# Altium schematic sheet Base.SchDoc
size Letter; CompanyName: PloopyCo; Organization: Ploopy Co; Address1: 137-1140 Burnhamthorpe Road W; Address2: Mississauga; Address3: Ontario; Address4: Canada L5C 0A3; DocumentNumber: 1; Revision: R1.004; SheetNumber: 1; SheetTotal: 8
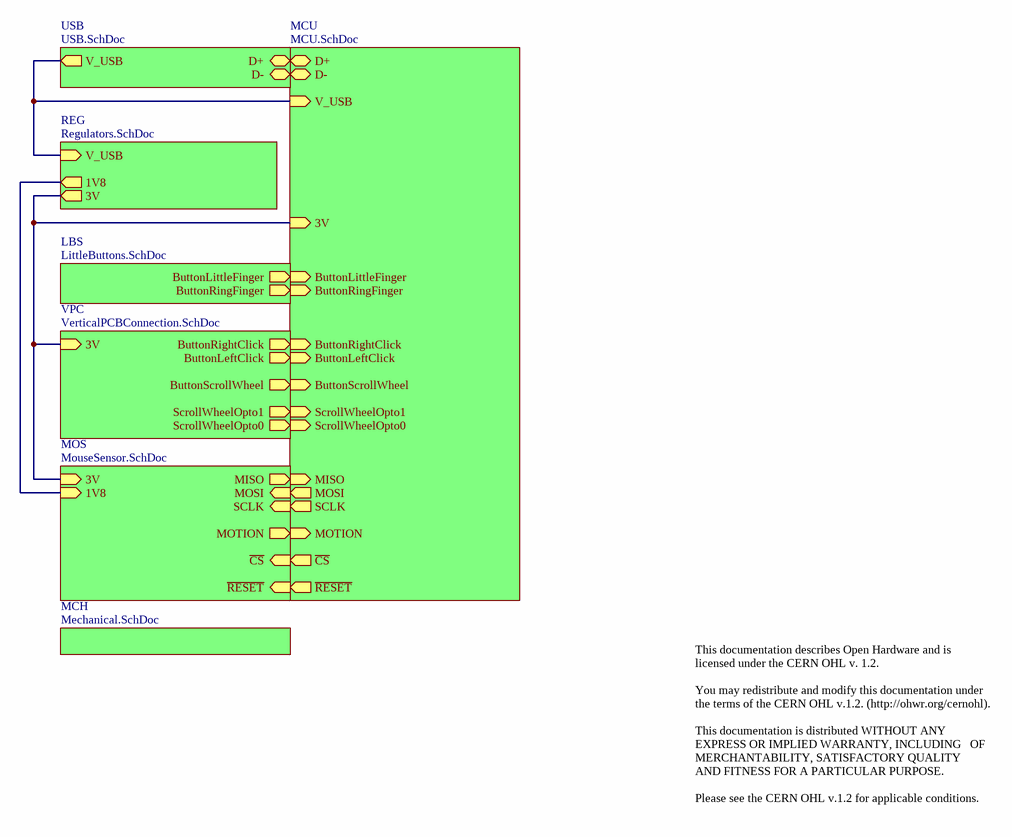
[diagram p0: Base.SchDoc]

## Sub-sheets
LBS = LittleButtons.SchDoc: ButtonLittleFinger (out), ButtonRingFinger (out)
MCH = Mechanical.SchDoc: no entries
MCU = MCU.SchDoc: 3V (in), D+ (bidir), D- (bidir), ButtonRightClick (in), ButtonLeftClick (in), ScrollWheelOpto1 (in), ScrollWheelOpto0 (in), ButtonScrollWheel (in), ButtonLittleFinger (in), ButtonRingFinger (in), ~{CS} (out), MISO (in), MOSI (out), SCLK (out), V_USB (in), ~{RESET} (out), MOTION (in)
MOS = MouseSensor.SchDoc: 1V8 (in), 3V (in), ~{CS} (in), MISO (out), MOSI (in), SCLK (in), ~{RESET} (in), MOTION (out)
REG = Regulators.SchDoc: 3V (out), V_USB (in), 1V8 (out)
USB = USB.SchDoc: D+ (bidir), V_USB (out), D- (bidir)
VPC = VerticalPCBConnection.SchDoc: 3V (in), ButtonRightClick (out), ButtonLeftClick (out), ScrollWheelOpto1 (out), ScrollWheelOpto0 (out), ButtonScrollWheel (out)

## Nets
(unnamed): sheet MCU/3V, sheet REG/3V, sheet VPC/3V, sheet MOS/3V
(unnamed): sheet MCU/D+, sheet USB/D+
(unnamed): sheet MCU/D-, sheet USB/D-
(unnamed): sheet MCU/ButtonRightClick, sheet VPC/ButtonRightClick
(unnamed): sheet MCU/ButtonLeftClick, sheet VPC/ButtonLeftClick
(unnamed): sheet MCU/ScrollWheelOpto1, sheet VPC/ScrollWheelOpto1
(unnamed): sheet MCU/ScrollWheelOpto0, sheet VPC/ScrollWheelOpto0
(unnamed): sheet MCU/ButtonScrollWheel, sheet VPC/ButtonScrollWheel
(unnamed): sheet MCU/ButtonLittleFinger, sheet LBS/ButtonLittleFinger
(unnamed): sheet MCU/ButtonRingFinger, sheet LBS/ButtonRingFinger
(unnamed): sheet MCU/~{CS}, sheet MOS/~{CS}
(unnamed): sheet MCU/MISO, sheet MOS/MISO
(unnamed): sheet MCU/MOSI, sheet MOS/MOSI
(unnamed): sheet MCU/SCLK, sheet MOS/SCLK
(unnamed): sheet MCU/V_USB, sheet REG/V_USB, sheet USB/V_USB
(unnamed): sheet MCU/~{RESET}, sheet MOS/~{RESET}
(unnamed): sheet MCU/MOTION, sheet MOS/MOTION
(unnamed): sheet REG/1V8, sheet MOS/1V8

## Notes on the sheet
- This documentation describes Open Hardware and is licensed under the CERN OHL v. 1.2.
  You may redistribute and modify this documentation under the terms of the CERN OHL v.1.2. (http://ohwr.org/cernohl).
  This documentation is distributed WITHOUT ANY EXPRESS OR IMPLIED WARRANTY, INCLUDING   OF MERCHANTABILITY, SATISFACTORY QUALITY   AND FITNESS FOR A PARTICULAR PURPOSE.
  Please see the CERN OHL v.1.2 for applicable conditions.
- Copyright Ploopy Corporation 2019
- Licensed under the CERN OHL v. 1.2
- http://ohwr.org/cernohl
- Title:
- PCB:
- Version:
- Ploopy Corporation
- Mississauga ON L5C 0A3
- 137-1140 Burnhamthorpe Road W
- Date:
- Time:
- Sheet
- of
- Canada